# Altium schematic sheet PowerDD2.SchDoc
size A4
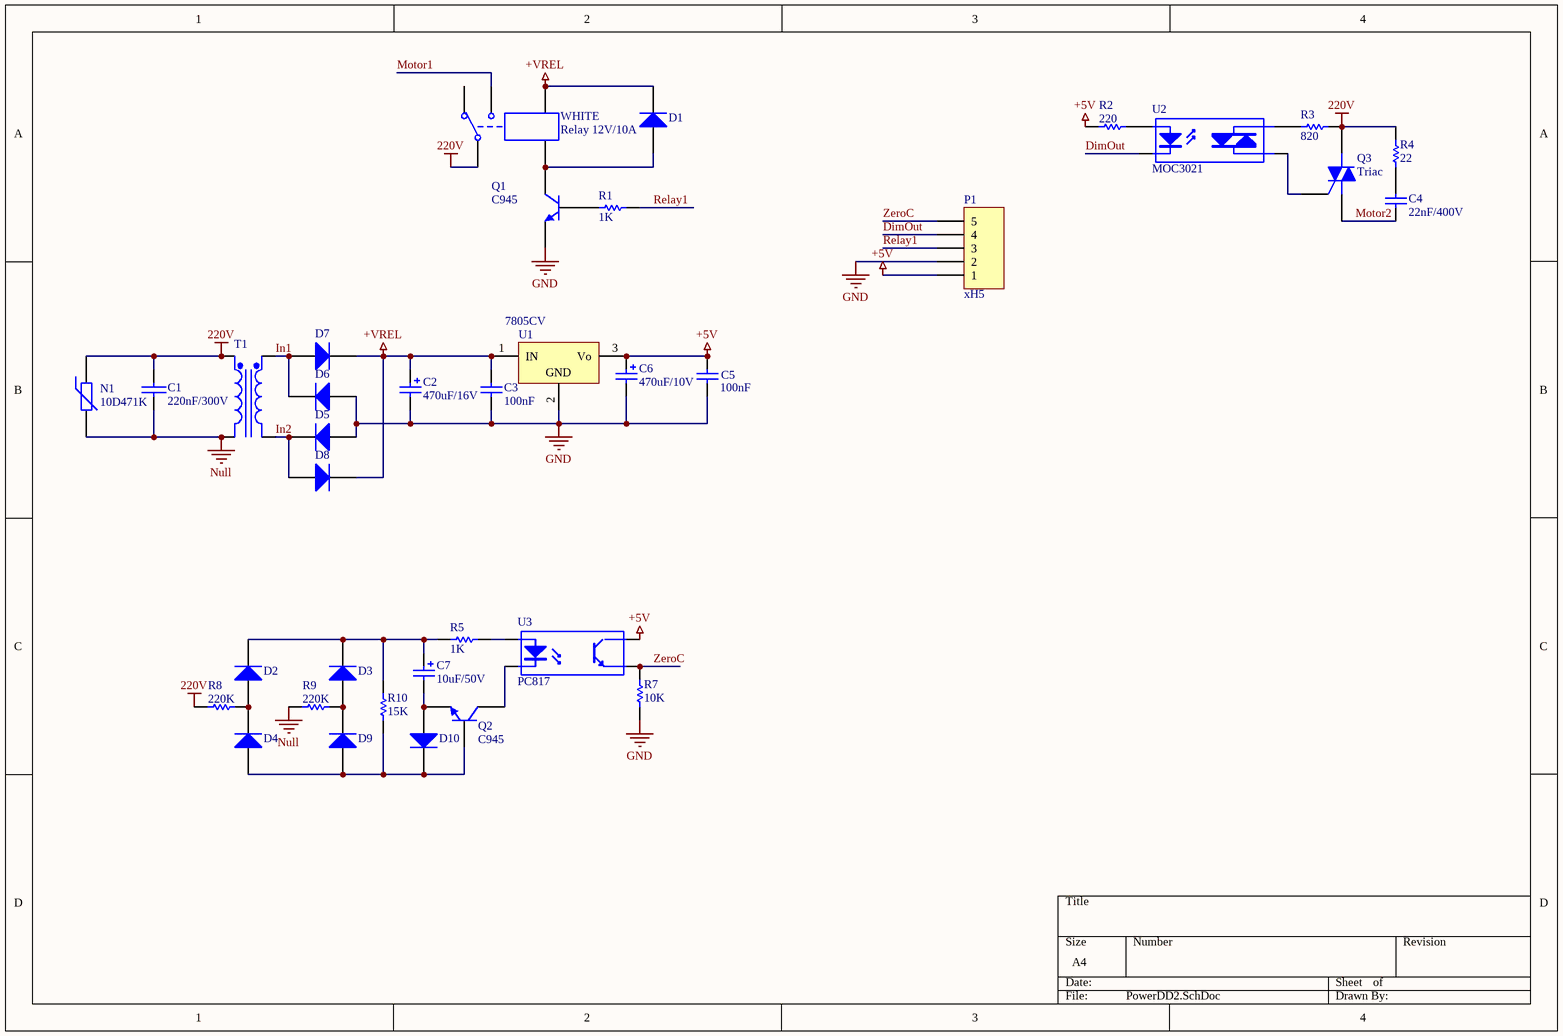
[diagram p0: PowerDD2.SchDoc]

## Parts
C1  220nF/300V  [Cap15]
C2  470uF/16V  [RB.2/.4]
C3  100nF  [RAD0.2]
C4  22nF/400V  [RAD0.2]
C5  100nF  [RAD0.2]
C6  470uF/10V  [RB.2/.4]
C7  10uF/50V  [RB.1/.2]
D1  1N4148  [DIODE0.35]  (value not drawn)
D2  1N4007  [DIODE0.4]  (value not drawn)
D3  1N4007  [DIODE0.4]  (value not drawn)
D4  1N4007  [DIODE0.4]  (value not drawn)
D5  1N4007  [DIODE0.4]  (value not drawn)
D6  1N4007  [DIODE0.4]  (value not drawn)
D7  1N4007  [DIODE0.4]  (value not drawn)
D8  1N4007  [DIODE0.4]  (value not drawn)
D9  1N4007  [DIODE0.4]  (value not drawn)
D10  1N4007  [DIODE0.4]  (value not drawn)
N1  10D471K  [varistor-10mil]
P1  xH5  [CON5]
Q1  C945  [TO92]
Q2  C945  [TO92]
Q3  Triac  [TO-220HS28]
R1  1K  [RES0.35]
R2  220  [RES0.35]
R3  820  [RES0.35]
R4  22  [RES0.35]
R5  1K  [RES0.35]
R7  10K  [RES0.35]
R8  220K  [RES0.35]
R9  220K  [RES0.35]
R10  15K  [RES0.35]
T1  Transformer  [Trans200mA]  (value not drawn)
U1  7805CV  [TO-220TriacHS]
U2  MOC3021  [DIP6]
U3  PC817  [DIP4-OPTO]
WHITE  Relay 12V/10A  [RELAY2]

## Nets
220V: C1.1 N1.1 Q3.2(M2) R3.1 R4.1 R8.1 T1.1(Pri+) WHITE.3(Com)
+5V: C5.2 C6.1 P1.1 R2.1 U1.3(Vo) U3.4(C)
+VREL: C2.1 C3.2 D1.2(K) D7.2(K) D8.2(K) U1.1(IN) WHITE.2(C2)
GND: C2.2 C3.1 C5.1 C6.2 D5.1(A) D6.1(A) P1.2 Q1.3(E) R7.2 U1.2(OUT)
Null: C1.2 N1.2 R9.1 T1.2(Pri-)
DimOut: P1.4 U2.2(K)
In1: D6.2(K) D7.1(A) T1.3(Sec+)
In2: D5.2(K) D8.1(A) T1.4(Sec-)
Motor1: WHITE.4(NO)
Motor2: C4.1 Q3.1(M1)
Relay1: P1.3 R1.1
ZeroC: P1.5 R7.1 U3.3(E)
NetC4_2: C4.2 R4.2
NetC7_1: C7.1 D2.2(K) D3.2(K) R5.2 R10.2
NetC7_2: C7.2 D10.1(A) Q2.3(E)
NetD1_1: D1.1(A) Q1.2(C) WHITE.1(C1)
NetD2_1: D2.1(A) D4.2(K) R8.2
NetD3_1: D3.1(A) D9.2(K) R9.2
NetD4_1: D4.1(A) D9.1(A) D10.2(K) Q2.1(B) R10.1
NetQ1_1: Q1.1(B) R1.2
NetQ2_2: Q2.2(C) U3.2(K)
NetQ3_3: Q3.3(G) U2.4(A/K)
NetR2_2: R2.2 U2.1(A)
NetR3_2: R3.2 U2.6(A/K)
NetR5_1: R5.1 U3.1(A)

Not connected (* = marked no-connect by the designer): WHITE 5(NC)

## Notes on the sheet
- (in symbol 7805) GND

## Library data of the parts
C1 = CAP: Line Cap
C2 = Cap Pol: Polarized Capacitor; Published: 8-Jun-2000; LatestRevisionDate: 17-Jul-2002; LatestRevisionNote: Re-released for DXP Platform.; PackageReference: RB7.6-15; Publisher: Altium Limited; Value: 470uF/16V
C3 C5 = Cap: Capacitor np; Published: 8-Jun-2000; LatestRevisionDate: 17-Jul-2002; LatestRevisionNote: Re-released for DXP Platform.; PackageReference: RAD-0.3; Publisher: Altium Limited; Value: 100nF
C4 = Cap: Capacitor; Value: 100pF; Published: 8-Jun-2000; LatestRevisionDate: 17-Jul-2002; LatestRevisionNote: Re-released for DXP Platform.; PackageReference: RAD-0.3; Publisher: Altium Limited
C6 C7 = Cap Pol: Polarized Capacitor; Value: 22uF; Published: 8-Jun-2000; LatestRevisionDate: 17-Jul-2002; LatestRevisionNote: Re-released for DXP Platform.; PackageReference: RB7.6-15; Publisher: Altium Limited
D1 = Diode: 1 Amp General Purpose Rectifier; Published: 8-Jun-2000; LatestRevisionDate: 17-Jul-2002; LatestRevisionNote: Re-released for DXP Platform.; DatasheetDocument: 1998; PackageDocument: Aug-1999; PackageReference: DO-41; Publisher: Altium Limited; Code_JEDEC: DO-204-AL; ComponentLink1Description: Manufacturer Link; ComponentLink1URL: http://www.fairchildsemi.com/; ComponentLink2Description: Datasheet; ComponentLink2URL: http://www.fairchildsemi.com/ds/1N%2F1N4001.pdf
D2-D10 = Diode: Published: 8-Jun-2000; LatestRevisionDate: 17-Jul-2002; LatestRevisionNote: Re-released for DXP Platform.; DatasheetDocument: 1998; PackageDocument: Aug-1999; PackageReference: DO-41; Publisher: Altium Limited; Code_JEDEC: DO-204-AL; ComponentLink1Description: Manufacturer Link; ComponentLink1URL: http://www.fairchildsemi.com/; ComponentLink2Description: Datasheet; ComponentLink2URL: http://www.fairchildsemi.com/ds/1N%2F1N4001.pdf
N1 = Res Varistor: Published: 24-Mar-1999; LatestRevisionDate: 04-Mar-2005; LatestRevisionNote: PCB Footprint replaced.; PackageReference: 6-0805; Publisher: Altium Limited
P1 = Header 5: Header, 5-Pin; LatestRevisionDate: 17-Jul-2002; LatestRevisionNote: Re-released for DXP Platform.; Publisher: Altium Limited
Q1 Q2 = BC337: NPN General Purpose Amplifier; Published: 8-Jun-2000; LatestRevisionDate: 15-Jan-2003; LatestRevisionNote: PCB Footprint 'BCY-W3/D4.7' replaced; DatasheetDocument: 1997; PackageDocument: Sep-1998; PackageReference: TO-92A; Publisher: Altium Limited; Code_JEDEC: TO-92A; ComponentLink1Description: Manufacturer Link; ComponentLink1URL: http://www.fairchildsemi.com/; ComponentLink2Description: Datasheet; ComponentLink2URL: http://www.fairchildsemi.com/ds/2N%2F2N3904.pdf
Q3 = Triac: Silicon Bidirectional Triode Thyristor; Note: Pin 2 is electrically connected to Pin 4 (TAB); Published: 29-Sep-2000; LatestRevisionDate: 17-Jul-2002; LatestRevisionNote: Re-released for DXP Platform.; DatasheetDocument: 1999; PackageReference: 369-03; Publisher: Altium Limited; Code_JEDEC: TO-251-AA; ComponentLink1Description: Manufacturer Link; ComponentLink1URL: http://www.motorola.com/
R1-R5 R7-R10 = Resistor: Published: 8-Jun-2000; LatestRevisionDate: 17-Jul-2002; LatestRevisionNote: Re-released for DXP Platform.; PackageReference: AXIAL-0.5; Publisher: Altium Limited
T1 = Transformer: 6Volt-300mA; Published: 8-Jun-2000; LatestRevisionDate: 17-Jul-2002; LatestRevisionNote: Re-released for DXP Platform.; PackageReference: TRF_4; Publisher: Altium Limited
U1 = 7805: Positive Voltage Regulator; Note: Tab is connected to pin 3 (GND).; Published: 24-Aug-2001; LatestRevisionDate: 17-Jul-2002; LatestRevisionNote: Re-released for DXP Platform.; DatasheetVersion: Dec-1998; PackageVersion: Jun-1998; PackageReference: TO220ABN; Publisher: Altium Limited; PackageDescription: TO, Thru-Hole, Vertical, Heatsink Mounted; 3 In-Line Leads; Pitch 2.54 mm; Pin sequence 1, 3, 2; ComponentLink1Description: Manufacturer Link; ComponentLink1URL: http://www.st.com/
U2 = Opto TRIAC_1: Opto-Triac; Published: 24-Mar-1999; LatestRevisionDate: 17-Jul-2002; LatestRevisionNote: Re-released for DXP Platform.; PackageReference: NPSIP4A; Publisher: Altium Limited
U3 = Optoisolator1: 4-Pin Phototransistor Optocoupler; Published: 24-Mar-1999; LatestRevisionDate: 04-Mar-2005; LatestRevisionNote: Sch pins 3 & 4 Swapped.; DatasheetDocument: Nov-2003; PackageReference: DIP-4; Publisher: Altium Limited
WHITE = Relay-SPDT: Milon; Published: 24-Mar-1999; LatestRevisionDate: 17-Jul-2002; LatestRevisionNote: Re-released for DXP Platform.; PackageReference: MODULE5B; Publisher: Altium Limited